# EAGLE schematic ESP32_breakout v2 (EAGLE 7.7.0)
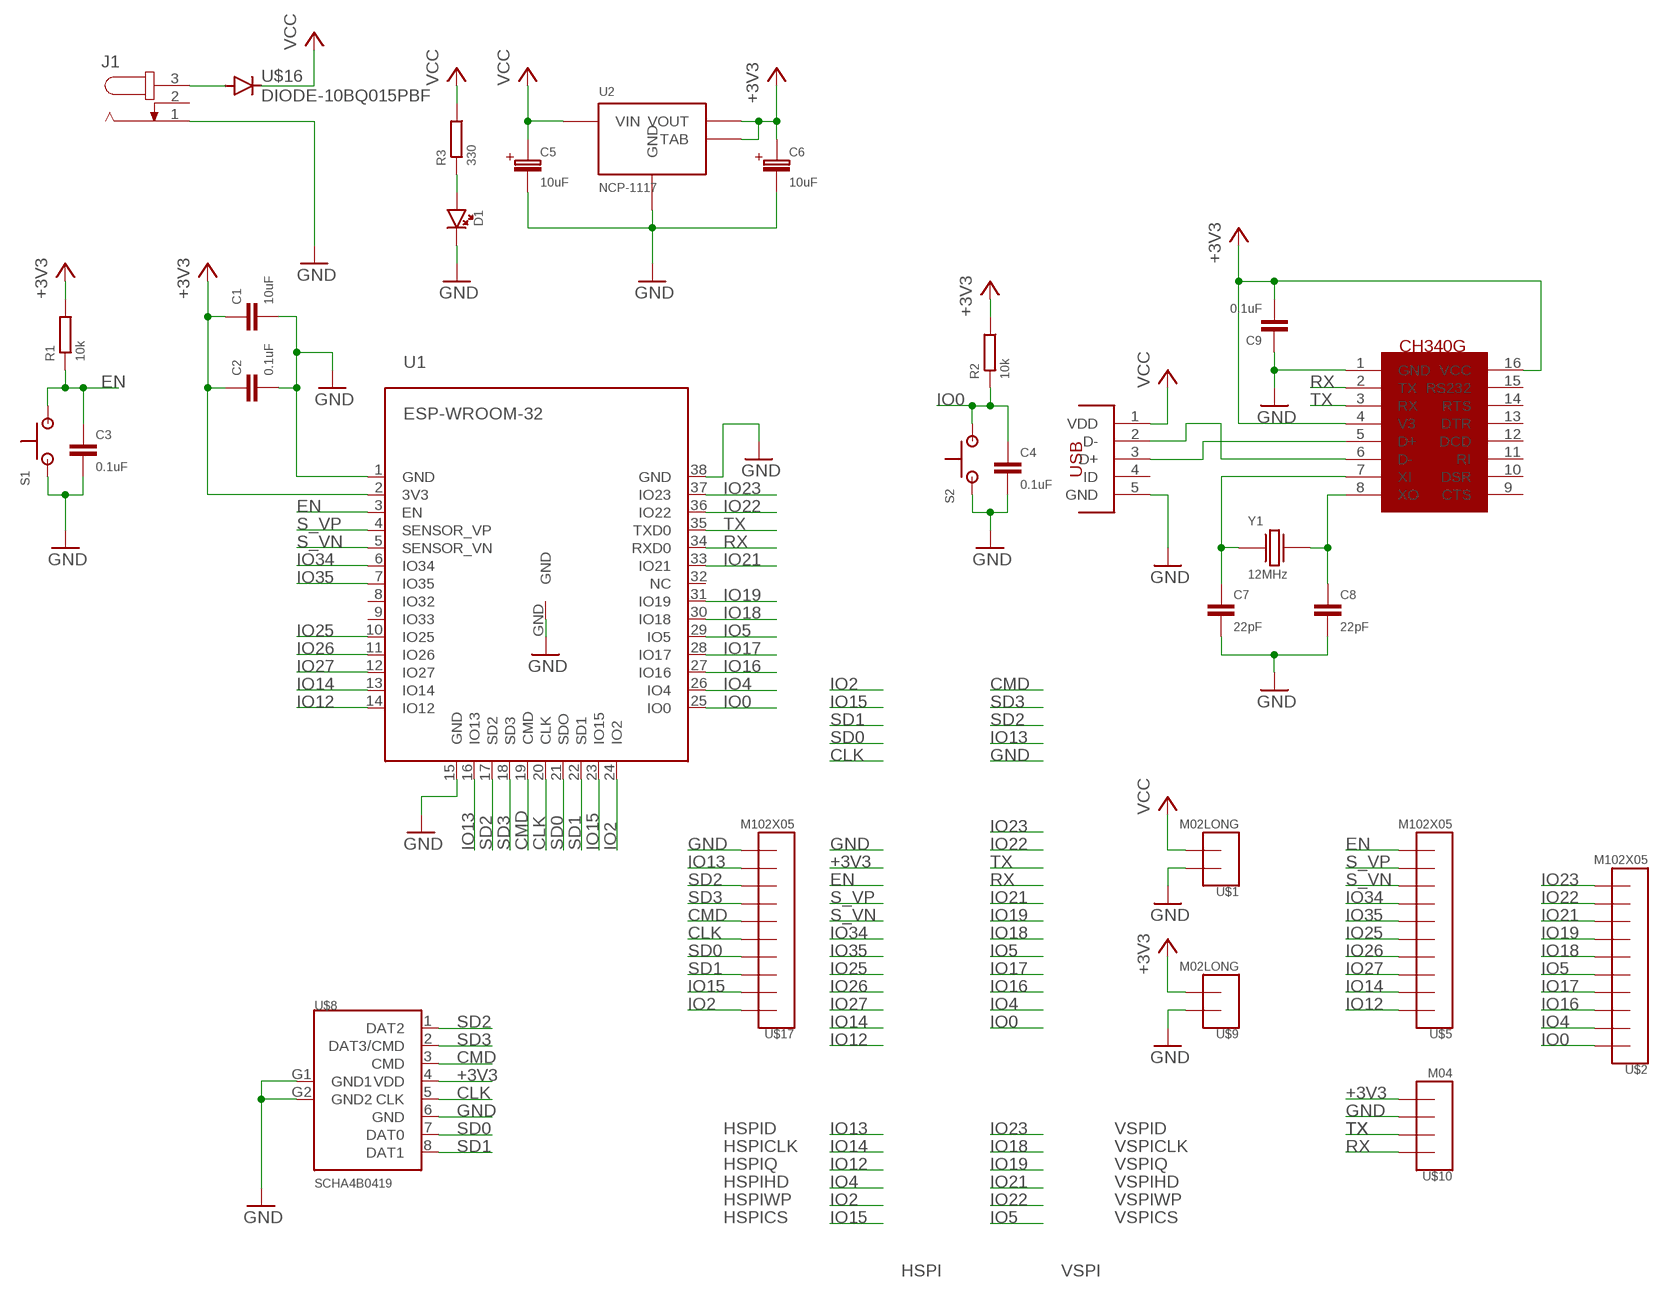
[diagram p0: schematic, sheet 1]

## Parts
C1  10uF  CAP0603  [CAP-0603]
C2  0.1uF  CAP0603  [CAP-0603]
C3  0.1uF  CAP0603  [CAP-0603]
C4  0.1uF  CAP0603  [CAP-0603]
C5  10uF  CAP-POLARCASEB-3528  [B-3528]
C6  10uF  CAP-POLARCASEB-3528  [B-3528]
C7  22pF  CAP0603  [CAP-0603]
C8  22pF  CAP0603  [CAP-0603]
C9  0.1uF  CAP0603  [CAP-0603]
D1  LED1206  [LED-1206]
J1  JACK-PLUG0  [SPC4077]
R1  10k  RESISTOR0603  [RES-0603]
R2  10k  RESISTOR0603  [RES-0603]
R3  330  RESISTOR0603  [RES-0603]
S1  PUSHBUTTONSKHMQME010  [SKHMQME010]
S2  PUSHBUTTONSKHMQME010  [SKHMQME010]
U1  ESP-WROOM-32  [ESP-WROOM-32]
U2  NCP-1117  [SOT-223-4]
U$1  M02LONG  [1X02-LONG]
U$2  M102X05  [2X05]
U$4  MOLEX_USBMICRO  [MOLEX_47346-001]
U$5  M102X05  [2X05]
U$7  CH340G  [SOIC16]
U$8  SCHA4B0419  [MICROSD_SCHA4B0419]
U$9  M02LONG  [1X02-LONG]
U$10  M04  [1X04]
U$16  DIODE-10BQ015PBF  [10BQ015PB]
U$17  M102X05  [2X05]
Y1  12MHz  ABLS-12MHZ-B2-T  [HC-49/US]

## Nets
+3V3: C1.1 C2.1 C6.P C9.2 R1.2 R2.2 U1.2(3V3) U2.2(VOUT) U2.PAD(TAB) U$7.4(V3) U$7.16(VCC) U$8.4(VDD) U$9.2 U$10.4
CLK: U1.20(CLK) U$8.5(CLK) U$17.5
CMD: U1.19(CMD) U$8.3(CMD) U$17.6
EN: C3.1 R1.1 S1.3 S1.4 U1.3(EN) U$5.10
GND: C1.2 C2.2 C3.2 C4.2 C5.N C6.N C7.2 C8.2 C9.1 D1.C J1.1 S1.1 S1.2 S2.1 S2.2 U1.1(GND) U1.15(GND) U1.38(GND) U1.GND U2.1(GND) U$1.1 U$4.5(GND) U$7.1(GND) U$8.6(GND) U$8.G1(GND1) U$8.G2(GND2) U$9.1 U$10.3 U$17.10
IO0: C4.1 R2.1 S2.3 S2.4 U1.25(IO0) U$2.1
IO2: U1.24(IO2) U$17.1
IO4: U1.26(IO4) U$2.2
IO5: U1.29(IO5) U$2.5
IO12: U1.14(IO12) U$5.1
IO13: U1.16(IO13) U$17.9
IO14: U1.13(IO14) U$5.2
IO15: U1.23(IO15) U$17.2
IO16: U1.27(IO16) U$2.3
IO17: U1.28(IO17) U$2.4
IO18: U1.30(IO18) U$2.6
IO19: U1.31(IO19) U$2.7
IO21: U1.33(IO21) U$2.8
IO22: U1.36(IO22) U$2.9
IO23: U1.37(IO23) U$2.10
IO25: U1.10(IO25) U$5.5
IO26: U1.11(IO26) U$5.4
IO27: U1.12(IO27) U$5.3
IO34: U1.6(IO34) U$5.7
IO35: U1.7(IO35) U$5.6
N$1: D1.A R3.1
N$2: J1.3 U$16.A
N$3: C7.1 U$7.7(XI) Y1.P$1
N$4: C8.1 U$7.8(XO) Y1.P$2
N$5: U$4.3(D+) U$7.5(D+)
N$6: U$4.2(D-) U$7.6(D-)
RX: U1.34(RXD0) U$7.2(TX) U$10.1
S_VN: U1.5(SENSOR_VN) U$5.8
S_VP: U1.4(SENSOR_VP) U$5.9
SD0: U1.21(SDO) U$8.7(DAT0) U$17.4
SD1: U1.22(SD1) U$8.8(DAT1) U$17.3
SD2: U1.17(SD2) U$8.1(DAT2) U$17.8
SD3: U1.18(SD3) U$8.2(DAT3/CMD) U$17.7
TX: U1.35(TXD0) U$7.3(RX) U$10.2
VCC: C5.P R3.2 U2.3(VIN) U$1.2 U$4.1(VDD) U$16.C
Unconnected: J1.2 S1.5 S2.5 U1.8(IO32) U1.9(IO33) U1.32(NC) U$4.4(ID) U$7.9(CTS) U$7.10(DSR) U$7.11(RI) U$7.12(DCD) U$7.13(DTR) U$7.14(RTS) U$7.15(RS232)

## Notes on the sheet
- HSPID | VSPID
- HSPICLK | VSPICLK
- HSPIQ | VSPIQ
- HSPIHD | VSPIHD
- HSPIWP | VSPIWP
- HSPICS | VSPICS
- HSPI | VSPI

## Library data of the parts
C1-C4 C7-C9 = dr-library:CAP: Multilayer Ceramic Capacitor
C5 C6 = dr-library:CAP-POLAR
D1 = dr-library:LED
J1 = EmbeddedAdventures 3:JACK-PLUG: DC POWER JACK Power Jack, DC, Right Angle, Through Hole, Rated 5A at 16VDC, PC Terminals Distributor: Farnell (www.Farnell.de) Drawing: 84N1161.pdf / 84N1162.pdf Manufacturer: SPC Technology (www.spctechnology.com) Type: SPC4077 / SPC 4078
R1-R3 = dr-library:RESISTOR
S1 S2 = dr-library:PUSHBUTTON: ALPS Tactile Switch 50mA at 12V Mouser Product # 688-SKHMQME010
U1 = dr-library:ESP-WROOM-32
U2 = dr-library:NCP-1117: ON Semiconductor Low Dropout Positive Voltage Regulator 1A output Datasheet: http://www.mouser.com/ds/2/308/NCP1117LP-D-82673.pdf
U$1 U$9 = dr-library:M02
U$2 U$5 U$17 = dr-library:M10
U$4 = dr-library:MOLEX_USBMICRO
U$7 = usb-serial:CH340G
U$8 = dr-library:SCHA4B0419: ALPS MicroSD Connector Manufacturer No. SCHA4B0419 http://www2.mouser.com/ProductDetail/ALPS/SCHA4B0419/?qs=sGAEpiMZZMuJakaoiLiBpsFSICW6cUCj0ci6XSEAGXcTwv1T7afZMw%3d%3d
U$10 = dr-library:M04
U$16 = EmbeddedAdventures 3:DIODE-10BQ015PBF
Y1 = dr-library:ABLS-12MHZ-B2-T: Abracon 12MHz Crystal 20ppm 18pF Load Cap Manufacturer Part No. - ABLS-12.000MHZ-B2-T